# Altium schematic sheet diapers.SchDoc
size A4
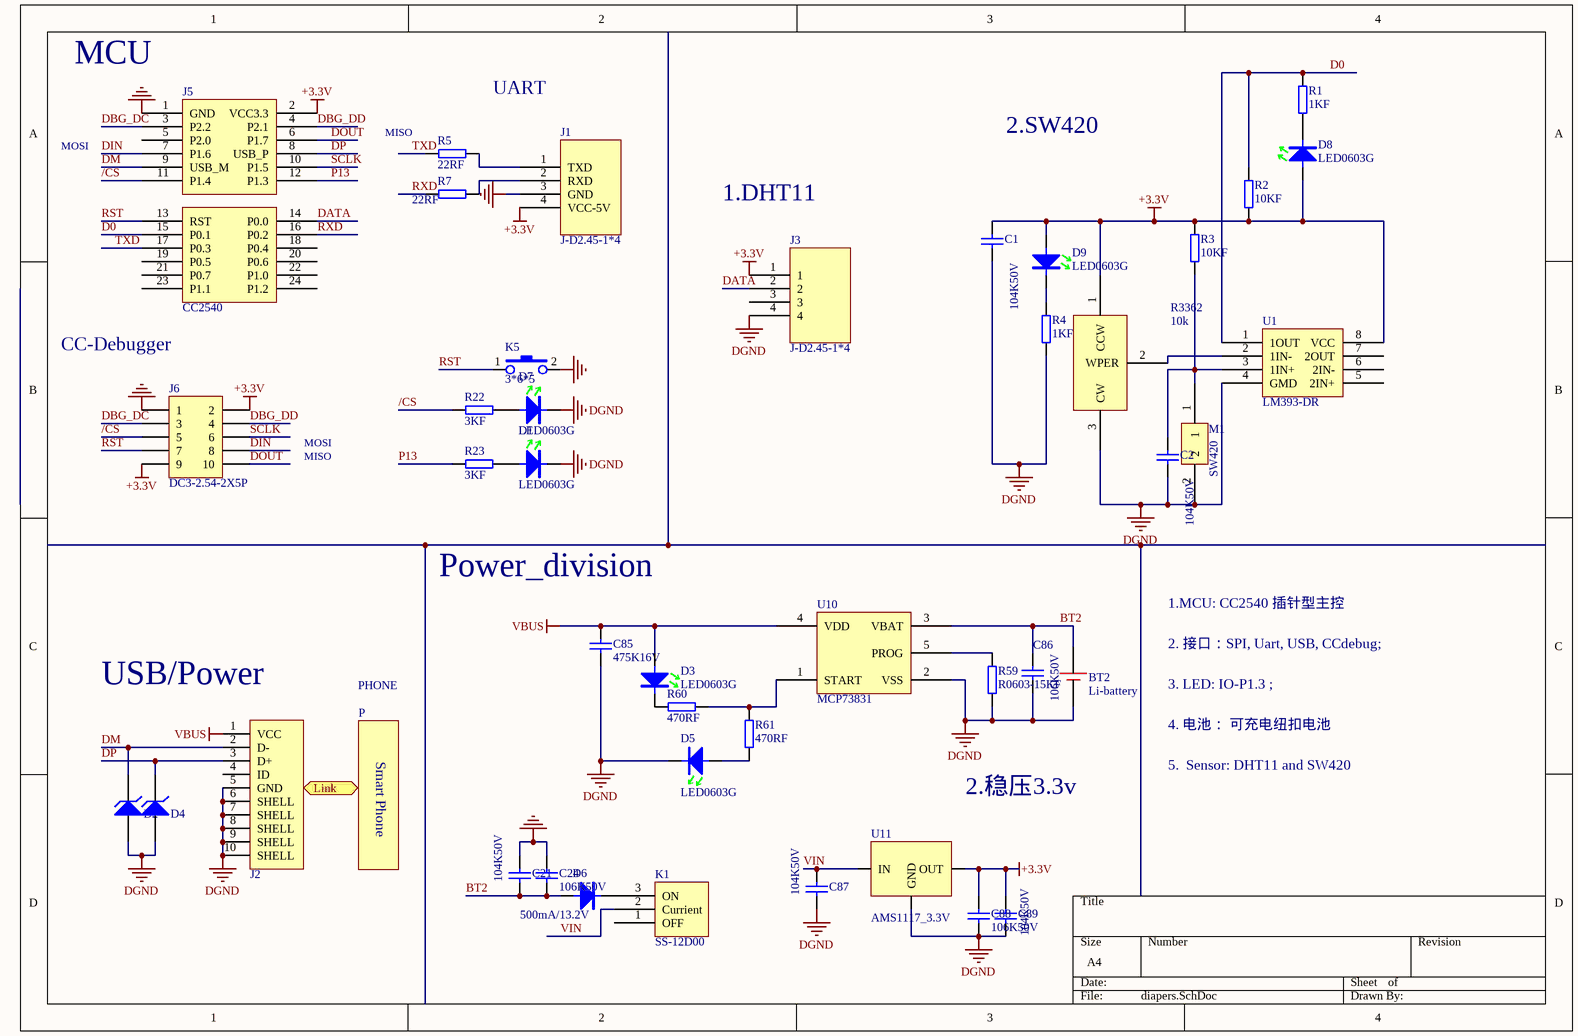
[diagram p0: diapers.SchDoc]

## Parts
BT2  Li-battery  [LIR2032]
C1  104K50V  [C0603]
C2  104K50V  [C0603]
C21  104K50V  [C0603]
C24  106K50V  [C0603]
C85  475K16V  [C0603]
C86  106K50V  [C0603]
C87  104K50V  [C0603]
C88  106K50V  [C0603]
C89  104K50V  [C0603]
D1  LED0603G  [D-LED0603G]
D2  ESDA_TR1/0603  [HS_0603D]  (value not drawn)
D3  LED0603G  [D-LED0603G]
D4  ESDA_TR1/0603  [HS_0603D]  (value not drawn)
D5  LED0603G  [D-LED0603G]
D6  500mA/13.2V  [D1206]
D7  LED0603G  [D-LED0603G]
D8  LED0603G  [D-LED0603G]
D9  LED0603G  [D-LED0603G]
J1  J-D2.45-1*4  [D2.54-1*4P]
J2  USB-MINI-SOCKET  [MICRO-USB - 5.9]  (value not drawn)
J3  J-D2.45-1*4  [D2.54-1*4P]
J5  CC2540  [PCBComponent_1]
J6  DC3-2.54-2X5P  [DC3-2.54-2X5P]
K1  SS-12D00  [SS-12D00]
K5  3*6*5  [S-K3*6]
M1  SW420  [SW420]
P  PHONE
R1  1KF  [R0603]
R2  10KF  [R0603]
R3  10KF  [R0603]
R4  1KF  [R0603]
R5  22RF  [R0603]
R7  22RF  [R0603]
R22  3KF  [R0603]
R23  3KF  [R0603]
R59  R0603-15KF  [R0603]
R60  470RF  [R0603]
R61  470RF  [R0603]
R3362  10k  [R3326P]
U1  LM393-DR  [LM393]
U10  MCP73831  [SOT23-5N]
U11  AMS1117_3.3V  [SOT-223]

## Ports
Link

## Nets
+3.3V: C1.1 C88.2 C89.1 D8.1 D9.1 J1.4(VCC-5V) J3.1 J5.2(VCC3.3) J6.2 J6.9 R2.1 R3.2 R3362.1(CCW) U1.8(VCC) U11.2(OUT)
DGND: BT2.2 C1.2 C2.2 C21.1 C24.2 C85.2 C86.2 C87.2 C88.1 C89.2 D1.2 D2.1(A) D4.1(A) D5.2 D7.2 J1.3(GND) J2.5(GND) J2.6(SHELL) J2.7(SHELL) J2.8(SHELL) J2.9(SHELL) J2.10(SHELL) J3.4 J5.1(GND) J6.1 K5.2 M1.2 R4.1 R59.1 R3362.3(CW) U1.4(GMD) U10.2(VSS) U11.1(GND)
VBUS: C85.1 D3.1 J2.1(VCC) U10.4(VDD)
/CS: J5.11(P1.4) J6.5 R22.1
BT2: BT2.1 C21.2 C24.1 C86.1 D6.1 U10.3(VBAT)
D0: J5.15(P0.1) R1.1 R2.2 U1.1(1OUT)
DATA: J3.2 J5.14(P0.0)
DBG_DC: J5.3(P2.2) J6.3
DBG_DD: J5.4(P2.1) J6.4
DIN: J5.7(P1.6) J6.8
DM: D2.2(K) J2.2(D-) J5.9(USB_M)
DOUT: J5.6(P1.7) J6.10
DP: D4.2(K) J2.3(D+) J5.8(USB_P)
P13: J5.12(P1.3) R23.1
RST: J5.13(RST) J6.7 K5.1
RXD: J5.16(P0.2) R7.2
SCLK: J5.10(P1.5) J6.6
TXD: J5.17(P0.3) R5.2
VIN: C87.1 K1.2(Currient) U11.3(IN)
NetC2_1: C2.1 M1.1 R3.1 U1.3(1IN+)
NetD1_1: D1.1 R23.2
NetD3_2: D3.2 R60.1
NetD5_1: D5.1 R61.1
NetD6_2: D6.2 K1.3(ON)
NetD7_1: D7.1 R22.2
NetD8_2: D8.2 R1.2
NetD9_2: D9.2 R4.2
NetJ1_1: J1.1(TXD) R5.1
NetJ1_2: J1.2(RXD) R7.1
NetR59_2: R59.2 U10.5(PROG)
NetR60_2: R60.2 R61.2 U10.1(START)
NetR3362_2: R3362.2(WPER) U1.2(1IN-)

Not connected (* = marked no-connect by the designer): J2 4(ID); J3 3; J5 5(P2.0) 18(P0.4) 19(P0.5) 20(P0.6) 21(P0.7) 22(P1.0) 23(P1.1) 24(P1.2); K1 1(OFF); U1 5(2IN+) 6(2IN-) 7(2OUT)

## Notes on the sheet
- MCU
- UART
- MOSI
- (near R5) MISO
- 2.SW420
- 1.DHT11
- CC-Debugger
- MISO
- Power_division
- 2. 接口：SPI, Uart, USB, CCdebug;
- 1.MCU: CC2540 插针型主控
- (near J2) USB/Power
- 3. LED: IO-P1.3 ;
- 4. 电池： 可充电纽扣电池
- 5.  Sensor: DHT11 and SW420
- 2.稳压3.3v
- (in symbol PHONE) Smart Phone

## Library data of the parts
BT2 = Li-batttery: 纽扣电池LIR2023
C1 C2 C21 C87 C89 = C0603X7R-104K50V: 贴片电容-陶瓷; 规格型号: 100nF±10%_50V_X7R_C0603; 生产商: 风华 三星; 供应商: *; 备注: *
C24 C86 C88 = C0603X7R-106K50V: 贴片电容-陶瓷; 规格型号: 10uF±10%_50V_X7R_C0603; 生产商: 风华 三星; 供应商: *; 备注: *
C85 = C0603X7R-475K16V: 贴片电容-陶瓷; 规格型号: 4.7uF±10%_16V_X7R_C0603; 生产商: 风华 三星; 供应商: *; 备注: *
D1 D3 D5 D7-D9 = DLED-0603-G: 贴片二极管-LED; 规格型号: 0603-GREEN; 货品编码: 无样品无编码; 生产商: *; 供应商: *; 备注: *
D2 D4 = D Zener: Zener Diode; Published: *; LatestRevisionDate: *; LatestRevisionNote: *; PackageReference: *; Publisher: *
D6 = 1206MSD: 500mA/13.2V 自恢复保险丝
J1 J3 = J-D2.54-1*4单排排母
J2 = J-USB-MINI-SOCKET: USB-A卧式插座; 供应商: *; 备注: *
J5 = CC2540: 蓝牙主控模块的接口
J6 = J-DC3-2.54-2X5P: 简牛插座-直针; 规格型号: 间距2.54 DC3 双排5P 简牛插座-直针; 货品编码: 371064; 生产商: 欧朗电子; 供应商: 欧朗电子; 备注: *
K1 = SS-12D00(1P2T) 立式 柄高5MM
K5 = 3*6*5: 贴片-卧式轻触开关
M1 = SW420: 长闭震动开关
R1 R4 = R0603-1KF: 贴片电阻-通用; 生产商: 厚声 国巨; 规格型号: 1K±1%_1/10W_±200ppm_R0603; 货品编码: 无样品无编码; 备注: *; 供应商: *
R2 R3 = R0603-10KF: 贴片电阻-通用; 生产商: 厚声 国巨; 规格型号: 10K±1%_1/10W_±200ppm_R0603; 备注: *; 供应商: *
R5 R7 = R0603-22RF: 贴片电阻-通用; 生产商: 厚声 国巨; 规格型号: 22R±5%_1/10W_±200ppm_R0603; 货品编码: 无样品无编码; 备注: *; 供应商: *
R22 R23 = R0603-3KF: 贴片电阻-通用; 生产商: 厚声 国巨; 规格型号: 3K±1%_1/10W_±200ppm_R0603; 货品编码: 无样品无编码; 备注: *; 供应商: *
R59 = R0603-15KF: 贴片电容-通用
R60 R61 = R0603-470RF: 贴片电阻-通用; 生产商: 厚声 国巨; 规格型号: 470R±1%_1/10W_±200ppm_R0603; 货品编码: 无样品无编码; 备注: *; 供应商: *
R3362 = R3362-10K: 电位器精密可调电阻
U1 = LM393-DR: 双路比较器
U10 = MCP73831: charge IC
U11 = AMS1117-3.3V